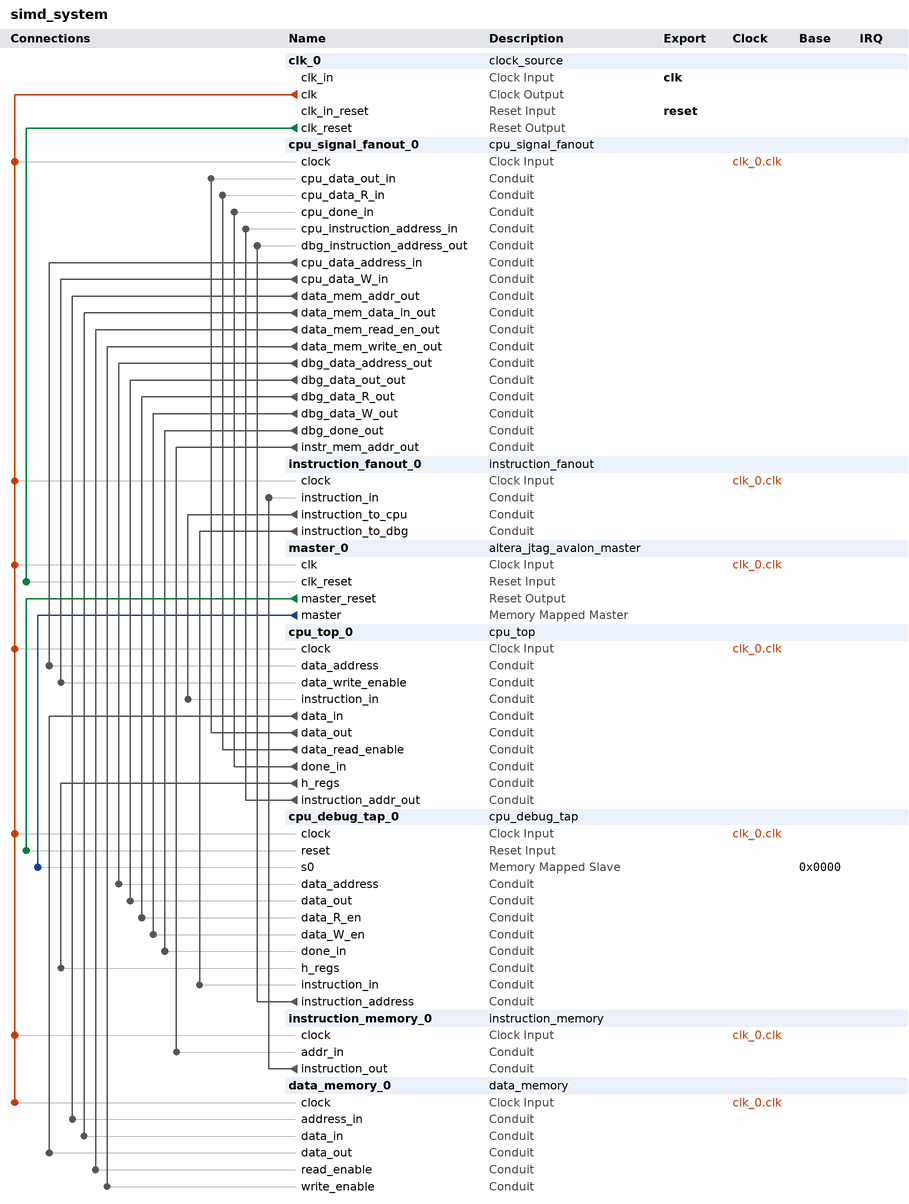
[diagram p0: system contents]
# Platform Designer (Qsys) system simd_system, Cyclone V 5CSEMA5F31C6
# Parameters at their usual value, and those the tool derives, are not listed.
package require -exact qsys 20.1
create_system simd_system
set_project_property DEVICE_FAMILY {Cyclone V}
set_project_property DEVICE 5CSEMA5F31C6

add_instance clk_0 clock_source 20.1
set_instance_parameter_value clk_0 clockFrequency 50000000

add_instance cpu_signal_fanout_0 cpu_signal_fanout 1.0

add_instance instruction_fanout_0 instruction_fanout 1.0

add_instance master_0 altera_jtag_avalon_master 20.1

add_instance cpu_top_0 cpu_top 1.0
set_instance_parameter_value cpu_top_0 STATE_EX 3
set_instance_parameter_value cpu_top_0 STATE_HALT 6
set_instance_parameter_value cpu_top_0 STATE_ID 2
set_instance_parameter_value cpu_top_0 STATE_IDLE 0
set_instance_parameter_value cpu_top_0 STATE_IF 1
set_instance_parameter_value cpu_top_0 STATE_MEM 4
set_instance_parameter_value cpu_top_0 STATE_WB 5

add_instance cpu_debug_tap_0 cpu_debug_tap 1.0

add_instance instruction_memory_0 instruction_memory 1.0

add_instance data_memory_0 data_memory 1.0

# connections
add_connection clk_0.clk cpu_debug_tap_0.clock clock
add_connection clk_0.clk cpu_signal_fanout_0.clock clock
add_connection clk_0.clk cpu_top_0.clock clock
add_connection clk_0.clk data_memory_0.clock clock
add_connection clk_0.clk instruction_fanout_0.clock clock
add_connection clk_0.clk instruction_memory_0.clock clock
add_connection clk_0.clk master_0.clk clock
add_connection clk_0.clk_reset master_0.clk_reset reset
add_connection master_0.master_reset cpu_debug_tap_0.reset reset
add_connection master_0.master cpu_debug_tap_0.s0 avalon
set_connection_parameter_value master_0.master/cpu_debug_tap_0.s0 baseAddress 0x0000
add_connection cpu_debug_tap_0.instruction_address cpu_signal_fanout_0.dbg_instruction_address_out conduit
add_connection cpu_signal_fanout_0.cpu_data_address_in cpu_top_0.data_address conduit
add_connection cpu_signal_fanout_0.cpu_data_W_in cpu_top_0.data_write_enable conduit
add_connection cpu_signal_fanout_0.data_mem_addr_out data_memory_0.address_in conduit
add_connection cpu_signal_fanout_0.data_mem_data_in_out data_memory_0.data_in conduit
add_connection cpu_signal_fanout_0.data_mem_read_en_out data_memory_0.read_enable conduit
add_connection cpu_signal_fanout_0.data_mem_write_en_out data_memory_0.write_enable conduit
add_connection cpu_signal_fanout_0.dbg_data_address_out cpu_debug_tap_0.data_address conduit
add_connection cpu_signal_fanout_0.dbg_data_out_out cpu_debug_tap_0.data_out conduit
add_connection cpu_signal_fanout_0.dbg_data_R_out cpu_debug_tap_0.data_R_en conduit
add_connection cpu_signal_fanout_0.dbg_data_W_out cpu_debug_tap_0.data_W_en conduit
add_connection cpu_signal_fanout_0.dbg_done_out cpu_debug_tap_0.done_in conduit
add_connection cpu_signal_fanout_0.instr_mem_addr_out instruction_memory_0.addr_in conduit
add_connection cpu_top_0.data_in data_memory_0.data_out conduit
add_connection cpu_top_0.data_out cpu_signal_fanout_0.cpu_data_out_in conduit
add_connection cpu_top_0.data_read_enable cpu_signal_fanout_0.cpu_data_R_in conduit
add_connection cpu_top_0.done_in cpu_signal_fanout_0.cpu_done_in conduit
add_connection cpu_top_0.h_regs cpu_debug_tap_0.h_regs conduit
add_connection cpu_top_0.instruction_addr_out cpu_signal_fanout_0.cpu_instruction_address_in conduit
add_connection instruction_fanout_0.instruction_to_cpu cpu_top_0.instruction_in conduit
add_connection instruction_fanout_0.instruction_to_dbg cpu_debug_tap_0.instruction_in conduit
add_connection instruction_memory_0.instruction_out instruction_fanout_0.instruction_in conduit

# exported interfaces
add_interface clk clock sink
set_interface_property clk EXPORT_OF clk_0.clk_in
add_interface reset reset sink
set_interface_property reset EXPORT_OF clk_0.clk_in_reset

set_interconnect_requirement {$system} qsys_mm.clockCrossingAdapter HANDSHAKE
set_interconnect_requirement {$system} qsys_mm.maxAdditionalLatency 0

save_system simd_system.qsys
